# EAGLE board Sensor Gabung (EAGLE 7.2.0), part 1 of 2
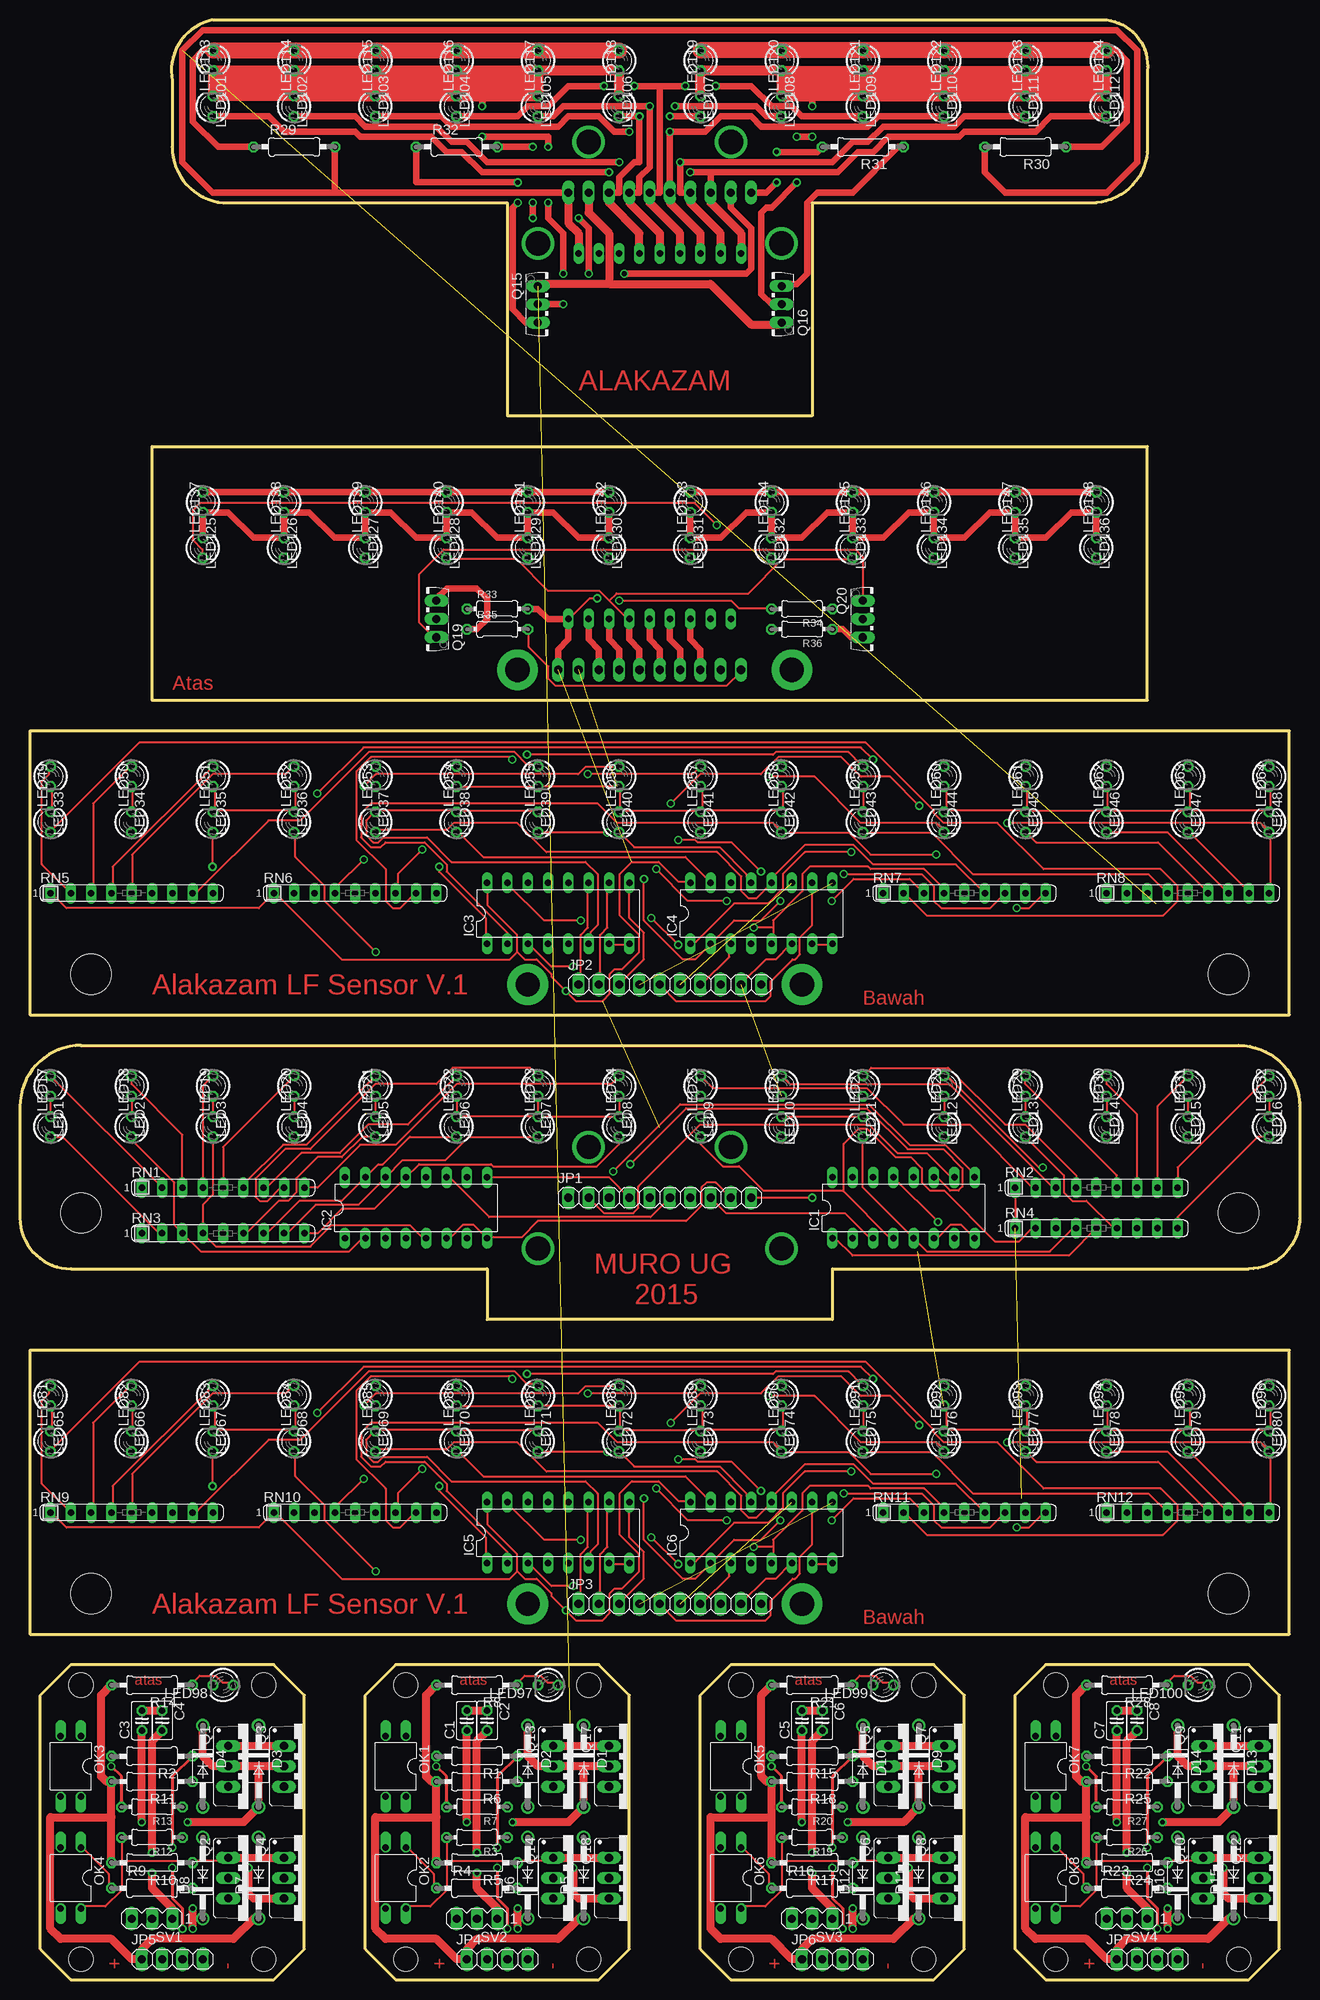
[diagram p9: board, top side]
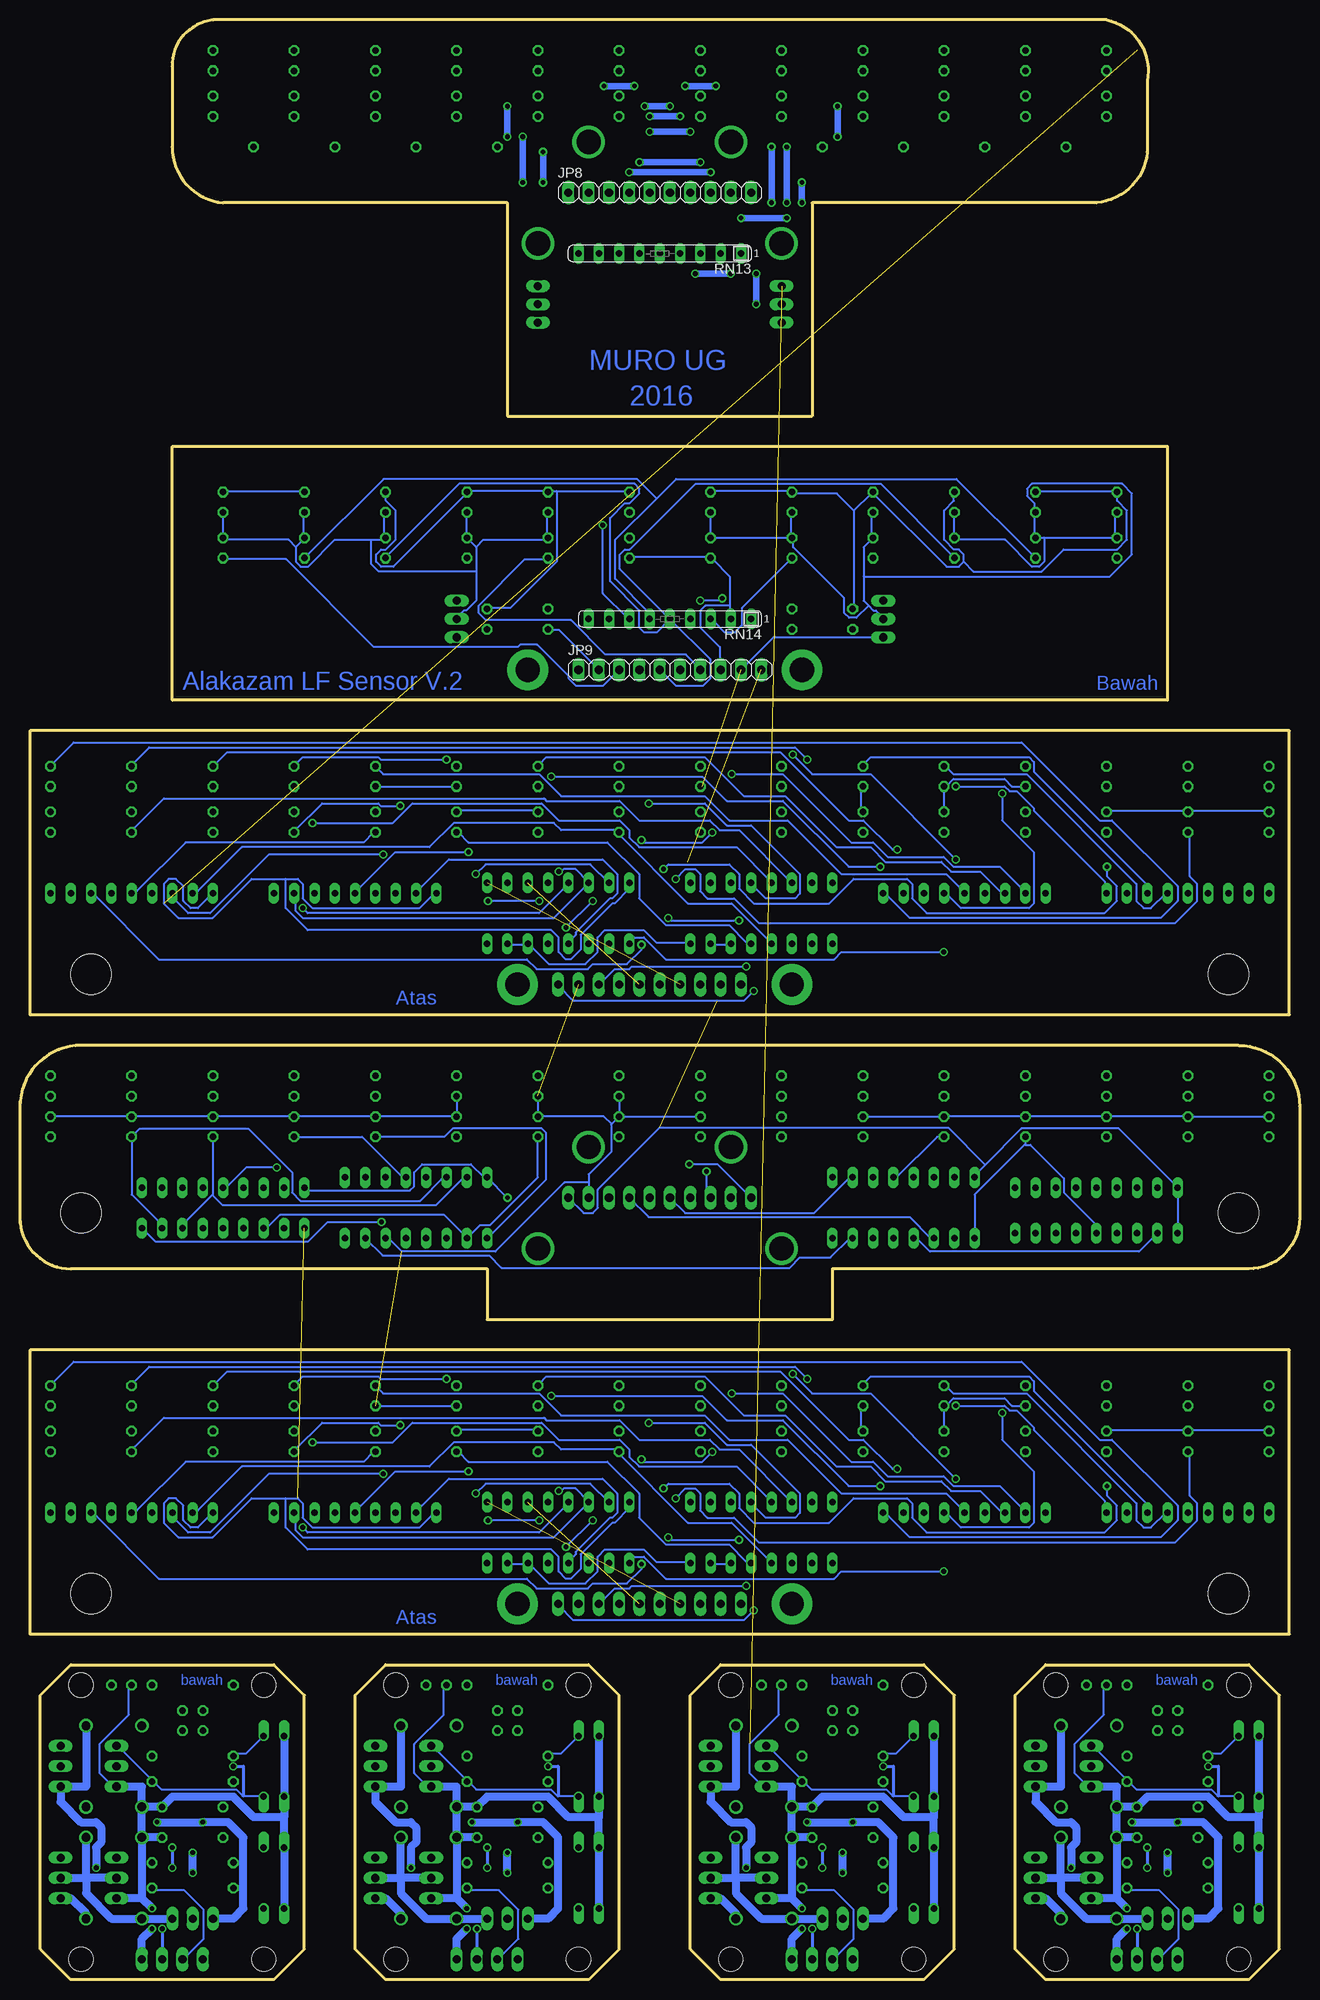
[diagram p10: board, bottom side, seen from below]

Size 160.02 x 245.11 mm. Coordinates in mm from the lower left corner, seen from the top.
Outline: 160.02,109.22 arc90 152.4,116.84 7.62,116.84 arc90 0,109.22 0,95.25 arc90 6.35,88.9 58.42,88.9 58.42,82.55 101.6,82.55 101.6,88.9 153.67,88.9 arc90 160.02,95.25
Outline: 160.02,109.85 160.02,109.22
Outline: 160.02,109.22 160.02,94.61
Outline: 140.97,229.87 arc-90 134.62,222.25 99.06,222.25 99.06,195.58 60.96,195.58 60.96,222.25 25.4,222.25 arc-90 19.05,229.87 19.05,237.49 arc-90 24.13,245.11 135.89,245.11 arc-90 140.97,238.76 140.97,229.24
Outline: 1.27,43.18 1.27,78.74 158.75,78.74 158.75,43.18 1.27,43.18
Outline: 46.99,0 72.39,0 76.2,3.81 76.2,35.56 72.39,39.37 46.99,39.37 43.18,35.56 43.18,3.81 46.99,0
Outline: 6.35,0 31.75,0 35.56,3.81 35.56,35.56 31.75,39.37 6.35,39.37 2.54,35.56 2.54,3.81 6.35,0
Outline: 88.9,0 114.3,0 118.11,3.81 118.11,35.56 114.3,39.37 88.9,39.37 85.09,35.56 85.09,3.81 88.9,0
Outline: 128.27,0 153.67,0 157.48,3.81 157.48,35.56 153.67,39.37 128.27,39.37 124.46,35.56 124.46,3.81 128.27,0
Outline: 1.27,120.65 1.27,156.21 158.75,156.21 158.75,120.65 1.27,120.65
Outline: 16.51,160.02 16.51,191.77 140.97,191.77 140.97,160.02 16.51,160.02
Copper layers (1*16): Top 0.035mm / dielectric 1.5mm / Bottom 0.035mm
Design rules "default": minimum track width 10mil, minimum drill 24mil, track to track 8mil, track to pad 8mil, pad to pad 8mil, via to via 8mil, smd to smd 8mil, copper to edge 40mil, drill to drill 8mil, minimum pad ring 10mil, minimum via ring 8mil, stop-mask expansion 4mil, vias tented up to drill 0mil, thermal gap 10mil
Net classes: 0 default: width 0.051 mm, clearance 0.051 mm
Holes 5.08 mm at 7.62,95.88 152.4,95.88 8.89,48.26 151.13,48.26 8.89,125.73 151.13,125.73
Holes 3.05 mm at 71.12,36.83 48.26,36.83 48.26,2.54 71.12,2.54 30.48,36.83 7.62,36.83 7.62,2.54 30.48,2.54 113.03,36.83 90.17,36.83 90.17,2.54 113.03,2.54 152.4,36.83 129.54,36.83 129.54,2.54 152.4,2.54

## Footprints (pad centres in the part's own frame; a part is rotated, then mirrored left to right if it is on the bottom)
C025-025X050 = drill 0.813 octagon: 1 -1.27,0; 2 1.27,0
DO41-10 = drill 1.118: A 5.08,0; C -5.08,0
DIL16 = drill 0.813 long: 1 -8.89,-3.81; 2 -6.35,-3.81; 3 -3.81,-3.81; 4 -1.27,-3.81; 5 1.27,-3.81; 6 3.81,-3.81; 7 6.35,-3.81; 8 8.89,-3.81; 9 8.89,3.81; 10 6.35,3.81; 11 3.81,3.81; 12 1.27,3.81; 13 -1.27,3.81; 14 -3.81,3.81; 15 -6.35,3.81; 16 -8.89,3.81
1X10 = drill 1.016 long: 1 -11.43,0; 2 -8.89,0; 3 -6.35,0; 4 -3.81,0; 5 -1.27,0; 6 1.27,0; 7 3.81,0; 8 6.35,0; 9 8.89,0; 10 11.43,0
1X04 = drill 1.016 long: 1 -3.81,0; 2 -1.27,0; 3 1.27,0; 4 3.81,0
LED3MM = drill 0.813 octagon: A -1.27,0; K 1.27,0
DIL04 = drill 0.813 offset: 1 -1.27,-3.81; 2 1.27,-3.81; 3 1.27,3.81; 4 -1.27,3.81
TO220BV = drill 1.016 long: D 0,-2.54; G -2.54,-2.54; S 2.54,-2.54
TO126AV = drill 1.016 long: B 2.286,-1.27; C 0,-1.27; E -2.286,-1.27
0207/10 = drill 0.813 octagon: 1 -5.08,0; 2 5.08,0
0204/7 = drill 0.813 octagon: 1 -3.81,0; 2 3.81,0
SIL9 = drill 0.813 long: 1 -10.16,0; 2 -7.62,0; 3 -5.08,0; 4 -2.54,0; 5 0,0; 6 2.54,0; 7 5.08,0; 8 7.62,0; 9 10.16,0
MA03-1 = drill 1.016 long: 1 -2.54,0; 2 0,0; 3 2.54,0

## Placement (x,y rotation side)
C1  [C025-025X050]  55.88,32.38 90 top
C2  [C025-025X050]  58.42,32.38 270 top
C3  [C025-025X050]  15.24,32.38 90 top
C4  [C025-025X050]  17.78,32.38 270 top
C5  [C025-025X050]  97.79,32.38 90 top
C6  [C025-025X050]  100.33,32.38 270 top
C7  [C025-025X050]  137.16,32.38 90 top
C8  [C025-025X050]  139.7,32.38 270 top
D1  1N4004  [DO41-10]  70.48,26.67 270 top
D2  1N4004  [DO41-10]  63.5,26.67 270 top
D3  1N4004  [DO41-10]  29.84,26.67 270 top
D4  1N4004  [DO41-10]  22.86,26.67 270 top
D5  1N4004  [DO41-10]  70.48,12.7 90 top
D6  1N4004  [DO41-10]  63.5,12.7 90 top
D7  1N4004  [DO41-10]  29.84,12.7 90 top
D8  1N4004  [DO41-10]  22.86,12.7 90 top
D9  1N4004  [DO41-10]  112.39,26.67 270 top
D10  1N4004  [DO41-10]  105.41,26.67 270 top
D11  1N4004  [DO41-10]  112.39,12.7 90 top
D12  1N4004  [DO41-10]  105.41,12.7 90 top
D13  1N4004  [DO41-10]  151.76,26.67 270 top
D14  1N4004  [DO41-10]  144.78,26.67 270 top
D15  1N4004  [DO41-10]  151.76,12.7 90 top
D16  1N4004  [DO41-10]  144.78,12.7 90 top
IC1  4051N  [DIL16]  110.49,96.52 0 top
IC2  4051N  [DIL16]  49.53,96.52 0 top
IC3  4051N  [DIL16]  67.31,133.35 0 top
IC4  4051N  [DIL16]  92.71,133.35 0 top
IC5  4051N  [DIL16]  67.31,55.88 0 top
IC6  4051N  [DIL16]  92.71,55.88 0 top
JP1  [1X10]  80.01,97.79 0 top
JP2  [1X10]  81.28,124.46 0 top
JP3  [1X10]  81.28,46.99 0 top
JP4  [1X04]  59.69,2.54 0 top
JP5  [1X04]  19.05,2.54 0 top
JP6  [1X04]  101.6,2.54 0 top
JP7  [1X04]  140.97,2.54 0 top
JP8  [1X10]  80.01,223.52 0 bottom
JP9  [1X10]  78.74,163.83 0 bottom
LED1  [LED3MM]  3.81,111.76 270 top
LED2  [LED3MM]  13.97,111.76 270 top
LED3  [LED3MM]  24.13,111.76 270 top
LED4  [LED3MM]  34.29,111.76 270 top
LED5  [LED3MM]  44.45,111.76 270 top
LED6  [LED3MM]  54.61,111.76 270 top
LED7  [LED3MM]  64.77,111.76 270 top
LED8  [LED3MM]  74.93,111.76 270 top
LED9  [LED3MM]  85.09,111.76 270 top
LED10  [LED3MM]  95.25,111.76 270 top
LED11  [LED3MM]  105.41,111.76 270 top
LED12  [LED3MM]  115.57,111.76 270 top
LED13  [LED3MM]  125.73,111.76 270 top
LED14  [LED3MM]  135.89,111.76 270 top
LED15  [LED3MM]  146.05,111.76 270 top
LED16  [LED3MM]  156.21,111.76 270 top
LED17  [LED3MM]  3.81,106.68 90 top
LED18  [LED3MM]  13.97,106.68 90 top
LED19  [LED3MM]  24.13,106.68 90 top
LED20  [LED3MM]  34.29,106.68 90 top
LED21  [LED3MM]  44.45,106.68 90 top
LED22  [LED3MM]  54.61,106.68 90 top
LED23  [LED3MM]  64.77,106.68 90 top
LED24  [LED3MM]  74.93,106.68 90 top
LED25  [LED3MM]  85.09,106.68 90 top
LED26  [LED3MM]  95.25,106.68 90 top
LED27  [LED3MM]  105.41,106.68 90 top
LED28  [LED3MM]  115.57,106.68 90 top
LED29  [LED3MM]  125.73,106.68 90 top
LED30  [LED3MM]  135.89,106.68 90 top
LED31  [LED3MM]  146.05,106.68 90 top
LED32  [LED3MM]  156.21,106.68 90 top
LED33  [LED3MM]  3.81,150.5 270 top
LED34  [LED3MM]  13.97,150.5 270 top
LED35  [LED3MM]  24.13,150.5 270 top
LED36  [LED3MM]  34.29,150.5 270 top
LED37  [LED3MM]  44.45,150.5 270 top
LED38  [LED3MM]  54.61,150.5 270 top
LED39  [LED3MM]  64.77,150.5 270 top
LED40  [LED3MM]  74.93,150.5 270 top
LED41  [LED3MM]  85.09,150.5 270 top
LED42  [LED3MM]  95.25,150.5 270 top
LED43  [LED3MM]  105.41,150.5 270 top
LED44  [LED3MM]  115.57,150.5 270 top
LED45  [LED3MM]  125.73,150.5 270 top
LED46  [LED3MM]  135.89,150.5 270 top
LED47  [LED3MM]  146.05,150.5 270 top
LED48  [LED3MM]  156.21,150.5 270 top
LED49  [LED3MM]  3.81,144.78 90 top
LED50  [LED3MM]  13.97,144.78 90 top
LED51  [LED3MM]  24.13,144.78 90 top
LED52  [LED3MM]  34.29,144.78 90 top
LED53  [LED3MM]  44.45,144.78 90 top
LED54  [LED3MM]  54.61,144.78 90 top
LED55  [LED3MM]  64.77,144.78 90 top
LED56  [LED3MM]  74.93,144.78 90 top
LED57  [LED3MM]  85.09,144.78 90 top
LED58  [LED3MM]  95.25,144.78 90 top
LED59  [LED3MM]  105.41,144.78 90 top
LED60  [LED3MM]  115.57,144.78 90 top
LED61  [LED3MM]  125.73,144.78 90 top
LED62  [LED3MM]  135.89,144.78 90 top
LED63  [LED3MM]  146.05,144.78 90 top
LED64  [LED3MM]  156.21,144.78 90 top
LED65  [LED3MM]  3.81,73.02 270 top
LED66  [LED3MM]  13.97,73.02 270 top
LED67  [LED3MM]  24.13,73.02 270 top
LED68  [LED3MM]  34.29,73.02 270 top
LED69  [LED3MM]  44.45,73.02 270 top
LED70  [LED3MM]  54.61,73.02 270 top
LED71  [LED3MM]  64.77,73.02 270 top
LED72  [LED3MM]  74.93,73.02 270 top
LED73  [LED3MM]  85.09,73.02 270 top
LED74  [LED3MM]  95.25,73.02 270 top
LED75  [LED3MM]  105.41,73.02 270 top
LED76  [LED3MM]  115.57,73.02 270 top
LED77  [LED3MM]  125.73,73.02 270 top
LED78  [LED3MM]  135.89,73.02 270 top
LED79  [LED3MM]  146.05,73.02 270 top
LED80  [LED3MM]  156.21,73.02 270 top
LED81  [LED3MM]  3.81,67.31 90 top
LED82  [LED3MM]  13.97,67.31 90 top
LED83  [LED3MM]  24.13,67.31 90 top
LED84  [LED3MM]  34.29,67.31 90 top
LED85  [LED3MM]  44.45,67.31 90 top
LED86  [LED3MM]  54.61,67.31 90 top
LED87  [LED3MM]  64.77,67.31 90 top
LED88  [LED3MM]  74.93,67.31 90 top
LED89  [LED3MM]  85.09,67.31 90 top
LED90  [LED3MM]  95.25,67.31 90 top
LED91  [LED3MM]  105.41,67.31 90 top
LED92  [LED3MM]  115.57,67.31 90 top
LED93  [LED3MM]  125.73,67.31 90 top
LED94  [LED3MM]  135.89,67.31 90 top
LED95  [LED3MM]  146.05,67.31 90 top
LED96  [LED3MM]  156.21,67.31 90 top
LED97  [LED3MM]  66.04,36.83 180 top
LED98  [LED3MM]  25.4,36.83 180 top
LED99  [LED3MM]  107.95,36.83 180 top
LED100  [LED3MM]  147.32,36.83 180 top
LED101  [LED3MM]  24.13,240.03 270 top
LED102  [LED3MM]  34.29,240.03 270 top
LED103  [LED3MM]  44.45,240.03 270 top
LED104  [LED3MM]  54.61,240.03 270 top
LED105  [LED3MM]  64.77,240.03 270 top
LED106  [LED3MM]  74.93,240.03 270 top
LED107  [LED3MM]  85.09,240.03 270 top
LED108  [LED3MM]  95.25,240.03 270 top
LED109  [LED3MM]  105.41,240.03 270 top
LED110  [LED3MM]  115.57,240.03 270 top
LED111  [LED3MM]  125.73,240.03 270 top
LED112  [LED3MM]  135.89,240.03 270 top
LED113  [LED3MM]  24.13,234.31 90 top
LED114  [LED3MM]  34.29,234.31 90 top
LED115  [LED3MM]  44.45,234.31 90 top
LED116  [LED3MM]  54.61,234.31 90 top
LED117  [LED3MM]  64.77,234.31 90 top
LED118  [LED3MM]  74.93,234.31 90 top
LED119  [LED3MM]  85.09,234.31 90 top
LED120  [LED3MM]  95.25,234.31 90 top
LED121  [LED3MM]  105.41,234.31 90 top
LED122  [LED3MM]  115.57,234.31 90 top
LED123  [LED3MM]  125.73,234.31 90 top
LED124  [LED3MM]  135.89,234.31 90 top
LED125  [LED3MM]  22.86,184.78 270 top
LED126  [LED3MM]  33.02,184.78 270 top
LED127  [LED3MM]  43.18,184.78 270 top
LED128  [LED3MM]  53.34,184.78 270 top
LED129  [LED3MM]  63.5,184.78 270 top
LED130  [LED3MM]  73.66,184.78 270 top
LED131  [LED3MM]  83.82,184.78 270 top
LED132  [LED3MM]  93.98,184.78 270 top
LED133  [LED3MM]  104.14,184.78 270 top
LED134  [LED3MM]  114.3,184.78 270 top
LED135  [LED3MM]  124.46,184.78 270 top
LED136  [LED3MM]  134.62,184.78 270 top
LED137  [LED3MM]  22.86,179.07 90 top
LED138  [LED3MM]  33.02,179.07 90 top
LED139  [LED3MM]  43.18,179.07 90 top
LED140  [LED3MM]  53.34,179.07 90 top
LED141  [LED3MM]  63.5,179.07 90 top
LED142  [LED3MM]  73.66,179.07 90 top
LED143  [LED3MM]  83.82,179.07 90 top
LED144  [LED3MM]  93.98,179.07 90 top
LED145  [LED3MM]  104.14,179.07 90 top
LED146  [LED3MM]  114.3,179.07 90 top
LED147  [LED3MM]  124.46,179.07 90 top
LED148  [LED3MM]  134.62,179.07 90 top
OK1  PC817  [DIL04]  46.99,26.67 180 top
OK2  PC817  [DIL04]  46.99,12.7 180 top
OK3  PC817  [DIL04]  6.35,26.67 180 top
OK4  PC817  [DIL04]  6.35,12.7 180 top
OK5  PC817  [DIL04]  88.9,26.67 180 top
OK6  PC817  [DIL04]  88.9,12.7 180 top
OK7  PC817  [DIL04]  128.27,26.67 180 top
OK8  PC817  [DIL04]  128.27,12.7 180 top
Q1  IRF530  [TO220BV]  28.57,26.67 270 top
Q2  IRF530  [TO220BV]  28.57,12.7 270 top
Q3  IRF9530  [TO220BV]  35.56,26.67 270 top
Q4  IRF9530  [TO220BV]  35.56,12.7 270 top
Q5  IRF530  [TO220BV]  111.12,26.67 270 top
Q6  IRF530  [TO220BV]  111.12,12.7 270 top
Q7  IRF9530  [TO220BV]  118.11,26.67 270 top
Q8  IRF9530  [TO220BV]  118.11,12.7 270 top
Q9  IRF530  [TO220BV]  150.5,26.67 270 top
Q10  IRF530  [TO220BV]  150.5,12.7 270 top
Q11  IRF9530  [TO220BV]  157.48,26.67 270 top
Q12  IRF9530  [TO220BV]  157.48,12.7 270 top
Q13  IRF530  [TO220BV]  69.22,26.67 270 top
Q14  IRF530  [TO220BV]  69.22,12.7 270 top
Q15  BD139  [TO126AV]  66.04,209.55 270 top
Q16  BD139  [TO126AV]  93.98,209.55 90 top
Q17  IRF9530  [TO220BV]  76.2,26.67 270 top
Q18  IRF9530  [TO220BV]  76.2,12.7 270 top
Q19  BD139  [TO126AV]  50.8,170.18 90 top
Q20  BD139  [TO126AV]  106.68,170.18 270 top
R1  [0207/10]  57.15,27.94 180 top
R2  [0207/10]  16.51,27.94 180 top
R3  [0204/7]  57.15,17.78 180 top
R4  [0207/10]  57.15,11.43 0 top
R5  [0207/10]  57.15,14.6 180 top
R6  [0207/10]  57.15,24.77 180 top
R7  [0204/7]  57.15,21.59 180 top
R8  [0207/10]  57.15,36.83 180 top
R9  [0207/10]  16.51,11.43 0 top
R10  [0207/10]  16.51,14.6 180 top
R11  [0207/10]  16.51,24.77 180 top
R12  [0204/7]  16.51,17.78 180 top
R13  [0204/7]  16.51,21.59 180 top
R14  [0207/10]  16.51,36.83 180 top
R15  [0207/10]  99.06,27.94 180 top
R16  [0207/10]  99.06,11.43 0 top
R17  [0207/10]  99.06,14.6 180 top
R18  [0207/10]  99.06,24.77 180 top
R19  [0204/7]  99.06,17.78 180 top
R20  [0204/7]  99.06,21.59 180 top
R21  [0207/10]  99.06,36.83 180 top
R22  [0207/10]  138.43,27.94 180 top
R23  [0207/10]  138.43,11.43 0 top
R24  [0207/10]  138.43,14.6 180 top
R25  [0207/10]  138.43,24.77 180 top
R26  [0204/7]  138.43,17.78 180 top
R27  [0204/7]  138.43,21.59 180 top
R28  [0207/10]  138.43,36.83 180 top
R29  [0207/10]  34.29,229.24 0 top
R30  [0207/10]  125.73,229.24 180 top
R31  [0207/10]  105.41,229.24 180 top
R32  [0207/10]  54.61,229.24 0 top
R33  [0204/7]  59.69,171.45 0 top
R34  [0204/7]  97.79,171.45 180 top
R35  [0204/7]  59.69,168.91 0 top
R36  [0204/7]  97.79,168.91 180 top
RN1  220  [SIL9]  25.4,99.06 0 top
RN2  220  [SIL9]  134.62,99.06 0 top
RN3  10K  [SIL9]  25.4,93.34 0 top
RN4  10K  [SIL9]  134.62,93.98 0 top
RN5  220  [SIL9]  13.97,135.89 0 top
RN6  220  [SIL9]  41.91,135.89 0 top
RN7  10K  [SIL9]  118.11,135.89 0 top
RN8  10K  [SIL9]  146.05,135.89 0 top
RN9  220  [SIL9]  13.97,58.42 0 top
RN10  220  [SIL9]  41.91,58.42 0 top
RN11  10K  [SIL9]  118.11,58.42 0 top
RN12  10K  [SIL9]  146.05,58.42 0 top
RN13  10K  [SIL9]  80.01,215.9 180 bottom
RN14  10K  [SIL9]  78.74,170.18 180 bottom
SV1  [MA03-1]  16.51,7.62 180 top
SV2  [MA03-1]  57.15,7.62 180 top
SV3  [MA03-1]  99.06,7.62 180 top
SV4  [MA03-1]  138.43,7.62 180 top